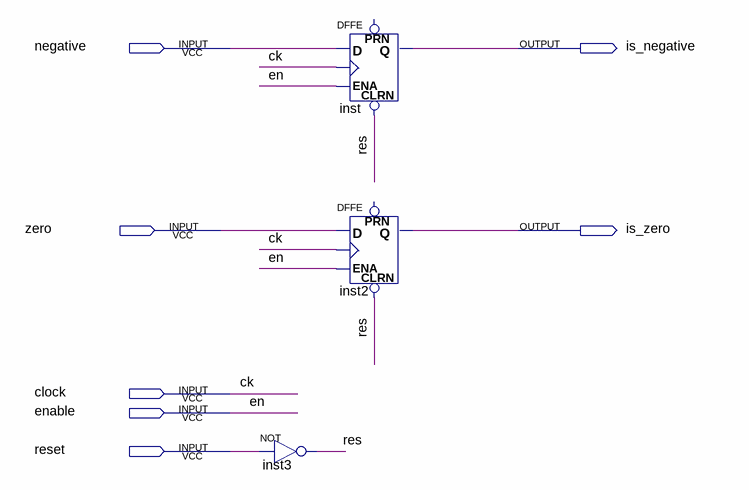
[diagram p0: schematic sheet]
// Quartus schematic reg_nz.bdf as structural Verilog: 3 symbols, 7 pins
module reg_nz (
  input  negative,
  input  zero,
  input  clock,
  input  enable,
  input  reset,
  output is_negative,
  output is_zero
);

  wire res;

  not inst3 (res, reset);
  DFFE inst (.CLRN(res), .D(negative), .CLK(clock), .ENA(enable), .Q(is_negative));  // open: PRN
  DFFE inst2 (.CLRN(res), .D(zero), .CLK(clock), .ENA(enable), .Q(is_zero));  // open: PRN

  // Other names for the same wires on the sheet: ck = clock; en = enable
endmodule
